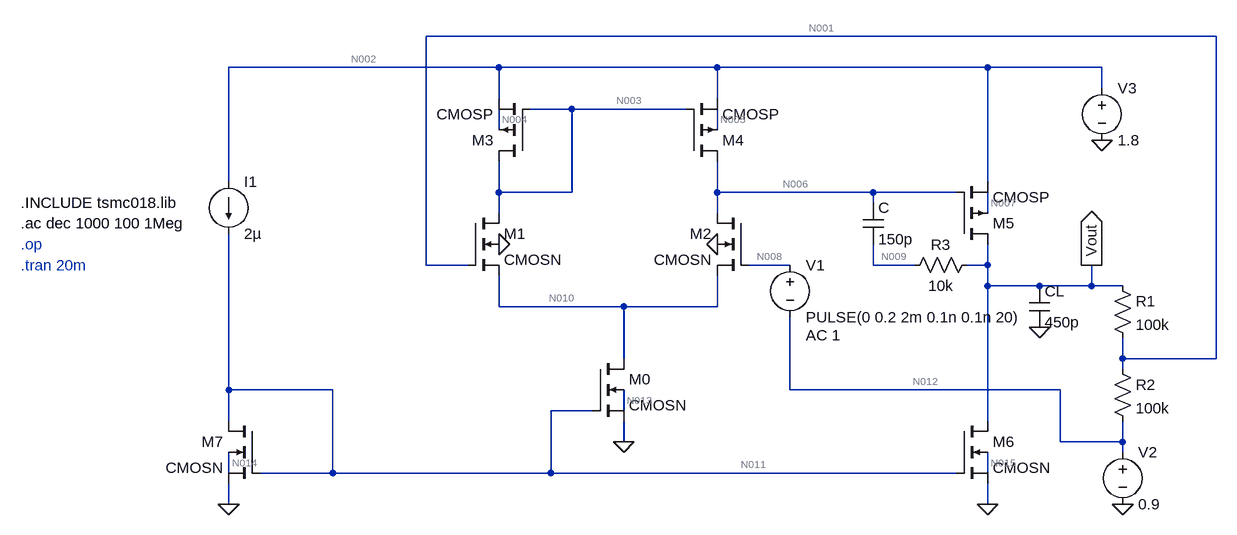
[diagram p0: schematic Non-inverting opamp.asc]
Non-inverting opamp.asc, the LTspice schematic file:
Version 4
SHEET 1 1016 680
WIRE 864 -288 -352 -288
WIRE -240 -240 -656 -240
WIRE 96 -240 -240 -240
WIRE 512 -240 96 -240
WIRE 688 -240 512 -240
WIRE 688 -208 688 -240
WIRE -240 -192 -240 -240
WIRE 96 -192 96 -240
WIRE -128 -176 -192 -176
WIRE 48 -176 -128 -176
WIRE -240 -144 -240 -176
WIRE 96 -144 96 -176
WIRE -656 -64 -656 -240
WIRE 512 -64 512 -240
WIRE -240 -48 -240 -96
WIRE -128 -48 -128 -176
WIRE -128 -48 -240 -48
WIRE 96 -48 96 -96
WIRE 336 -48 96 -48
WIRE 464 -48 336 -48
WIRE 336 -32 336 -48
WIRE -240 -16 -240 -48
WIRE 96 -16 96 -48
WIRE 512 -16 512 -48
WIRE -352 64 -352 -288
WIRE -288 64 -352 64
WIRE 208 64 144 64
WIRE 336 64 336 32
WIRE 400 64 336 64
WIRE 512 64 512 32
WIRE 512 64 480 64
WIRE 512 96 512 64
WIRE 592 96 512 96
WIRE 672 96 672 64
WIRE 672 96 592 96
WIRE 720 96 672 96
WIRE -240 128 -240 80
WIRE -48 128 -240 128
WIRE 96 128 96 80
WIRE 96 128 -48 128
WIRE -48 208 -48 128
WIRE 720 208 720 176
WIRE 864 208 864 -288
WIRE 864 208 720 208
WIRE 720 224 720 208
WIRE -656 256 -656 16
WIRE -496 256 -656 256
WIRE 208 256 208 144
WIRE 624 256 208 256
WIRE -96 288 -160 288
WIRE -48 288 -48 256
WIRE -656 304 -656 256
WIRE 512 304 512 96
WIRE -48 336 -48 304
WIRE 624 336 624 256
WIRE 720 336 720 304
WIRE 720 336 624 336
WIRE 720 352 720 336
WIRE -656 384 -656 352
WIRE -496 384 -496 256
WIRE -496 384 -608 384
WIRE -160 384 -160 288
WIRE -160 384 -496 384
WIRE 464 384 -160 384
WIRE 512 384 512 352
WIRE -656 432 -656 400
WIRE 512 432 512 400
FLAG 688 -128 0
FLAG -48 336 0
FLAG 512 432 0
FLAG -656 432 0
FLAG 592 160 0
FLAG -240 32 0
FLAG 96 32 0
FLAG 672 64 Vout
IOPIN 672 64 Out
FLAG 720 432 0
SYMBOL cmosn -288 -16 R0
SYMATTR InstName M1
SYMATTR Value2 l=1700n w=15000n
SYMBOL cmosn 144 -16 M0
SYMATTR InstName M2
SYMATTR Value2 l=1700n w=15000n
SYMBOL cmosn -96 208 R0
SYMATTR InstName M0
SYMATTR Value2 l=900n w=16000n
SYMBOL cmosp 464 32 M180
SYMATTR InstName M5
SYMATTR Value2 l=900n w=18000n
SYMBOL voltage 688 -224 R0
WINDOW 123 0 0 Left 0
WINDOW 39 0 0 Left 0
SYMATTR InstName V3
SYMATTR Value 1.8
SYMBOL cap 576 96 R0
SYMATTR InstName CL
SYMATTR Value 450p
SYMBOL cmosn -608 304 M0
SYMATTR InstName M7
SYMATTR Value2 l=900n w=1600n
SYMBOL cmosn 464 304 R0
SYMATTR InstName M6
SYMATTR Value2 l=900n w=8000n
SYMBOL current -656 -64 R0
WINDOW 123 0 0 Left 0
WINDOW 39 0 0 Left 0
SYMATTR InstName I1
SYMATTR Value 2µ
SYMBOL cmosp -192 -96 R180
SYMATTR InstName M3
SYMATTR Value2 l=1700n w=34000n
SYMBOL cmosp 48 -96 M180
SYMATTR InstName M4
SYMATTR Value2 l=1700n w=34000n
SYMBOL voltage 208 48 R0
WINDOW 123 24 124 Left 2
WINDOW 39 0 0 Left 0
SYMATTR Value2 AC 1
SYMATTR InstName V1
SYMATTR Value PULSE(0 0.2 2m 0.1n 0.1n 20)
SYMBOL res 704 80 R0
SYMATTR InstName R1
SYMATTR Value 100k
SYMBOL res 704 208 R0
SYMATTR InstName R2
SYMATTR Value 100k
SYMBOL voltage 720 336 R0
WINDOW 123 0 0 Left 0
WINDOW 39 0 0 Left 0
SYMATTR InstName V2
SYMATTR Value 0.9
SYMBOL res 496 48 R90
WINDOW 0 0 56 VBottom 2
WINDOW 3 32 56 VTop 2
SYMATTR InstName R3
SYMATTR Value 10k
SYMBOL cap 320 -32 R0
SYMATTR InstName C
SYMATTR Value 150p
TEXT -976 32 Left 2 ;.op
TEXT -976 -32 Left 2 !.INCLUDE tsmc018.lib
TEXT -976 0 Left 2 !.ac dec 1000 100 1Meg
TEXT -976 64 Left 2 ;.tran 20m

The netlist it stands for:
* Non-inverting opamp.asc
M1 N003 N001 N010 0 CMOSN l=1700n w=15000n
M2 N006 N008 N010 0 CMOSN l=1700n w=15000n
M0 N010 N011 0 N013 CMOSN l=900n w=16000n
M5 Vout N006 N002 N007 CMOSP l=900n w=18000n
V3 N002 0 1.8
CL Vout 0 450p
M7 N011 N011 0 N014 CMOSN l=900n w=1600n
M6 Vout N011 0 N015 CMOSN l=900n w=8000n
I1 N002 N011 2µ
M3 N003 N003 N002 N004 CMOSP l=1700n w=34000n
M4 N006 N003 N002 N005 CMOSP l=1700n w=34000n
V1 N008 N012 PULSE(0 0.2 2m 0.1n 0.1n 20) AC 1
R1 Vout N001 100k
R2 N001 N012 100k
V2 N012 0 0.9
R3 Vout N009 10k
C N006 N009 150p
.model NMOS NMOS
.model PMOS PMOS
.lib standard.mos
* .op
.INCLUDE tsmc018.lib
.ac dec 1000 100 1Meg
* .tran 20m
.backanno
.end

* Results of the author's LTspice run, read from the files saved beside the schematic
* Operating Point, zero values left out:
*   V(n003) = 1.314 V
*   V(n001) = 899.7 mV
*   V(n010) = 334.3 mV
*   V(n006) = 1.291 V
*   V(n008) = 900 mV
*   V(n011) = 478.7 mV
*   V(n013) = 69.37 mV
*   V(vout) = 899.4 mV
*   V(n002) = 1.8 V
*   V(n007) = 1.659 V
*   V(n014) = 83.17 mV
*   V(n015) = 106 mV
*   V(n004) = 1.664 V
*   V(n005) = 1.664 V
*   V(n012) = 900 mV
*   V(n009) = 899.4 mV
*   Id(M1) = 8.866 µA
*   Ib(M1) = -1.668 pA
*   Is(M1) = -8.866 µA
*   Id(M2) = 8.894 µA
*   Ib(M2) = -1.645 pA
*   Is(M2) = -8.894 µA
*   Id(M0) = 17.76 µA
*   Is(M0) = -17.76 µA
*   Id(M7) = 2 µA
*   Is(M7) = -2 µA
*   Id(M6) = 11.16 µA
*   Is(M6) = -11.16 µA
*   Id(M5) = -11.16 µA
*   Ib(M5) = -1.659 pA
*   Is(M5) = 11.16 µA
*   Id(M3) = -8.866 µA
*   Ib(M3) = -1.664 pA
*   Is(M3) = 8.866 µA
*   Id(M4) = -8.894 µA
*   Ib(M4) = -1.664 pA
*   Is(M4) = 8.894 µA
*   I(I1) = 2 µA
*   I(R1) = -2.974 nA
*   I(R2) = -2.974 nA
*   I(V3) = -30.92 µA
*   I(V2) = -2.974 nA
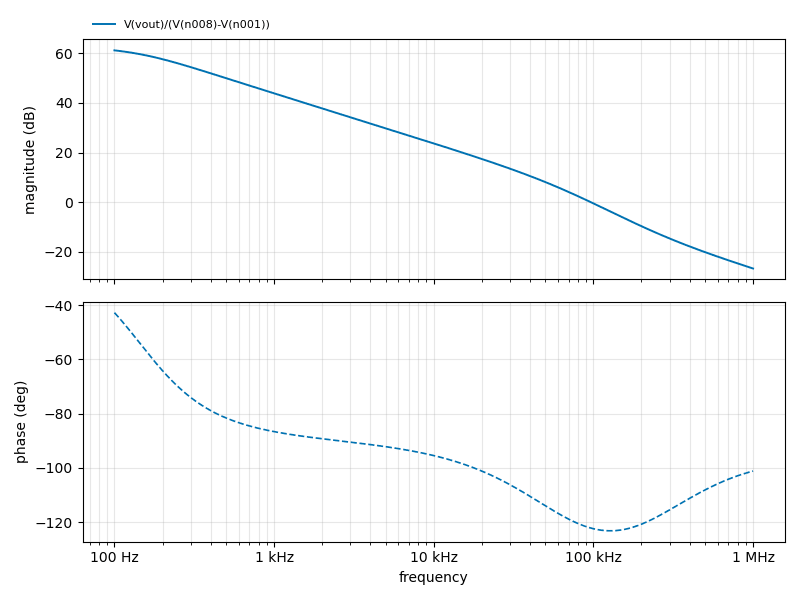
[diagram p1: AC Analysis of Non-inverting opamp.asc, plotted from the saved traces]
* AC Analysis, 1 run:
*   V(vout)/(V(n008)-V(n001)): 61.12 dB at 100 Hz, -26.64 dB at 1 MHz, peak 61.12 dB at 100 Hz, 3 dB below the peak at 184.8 Hz